# EAGLE design wemos_ora (EAGLE 7.4.0)
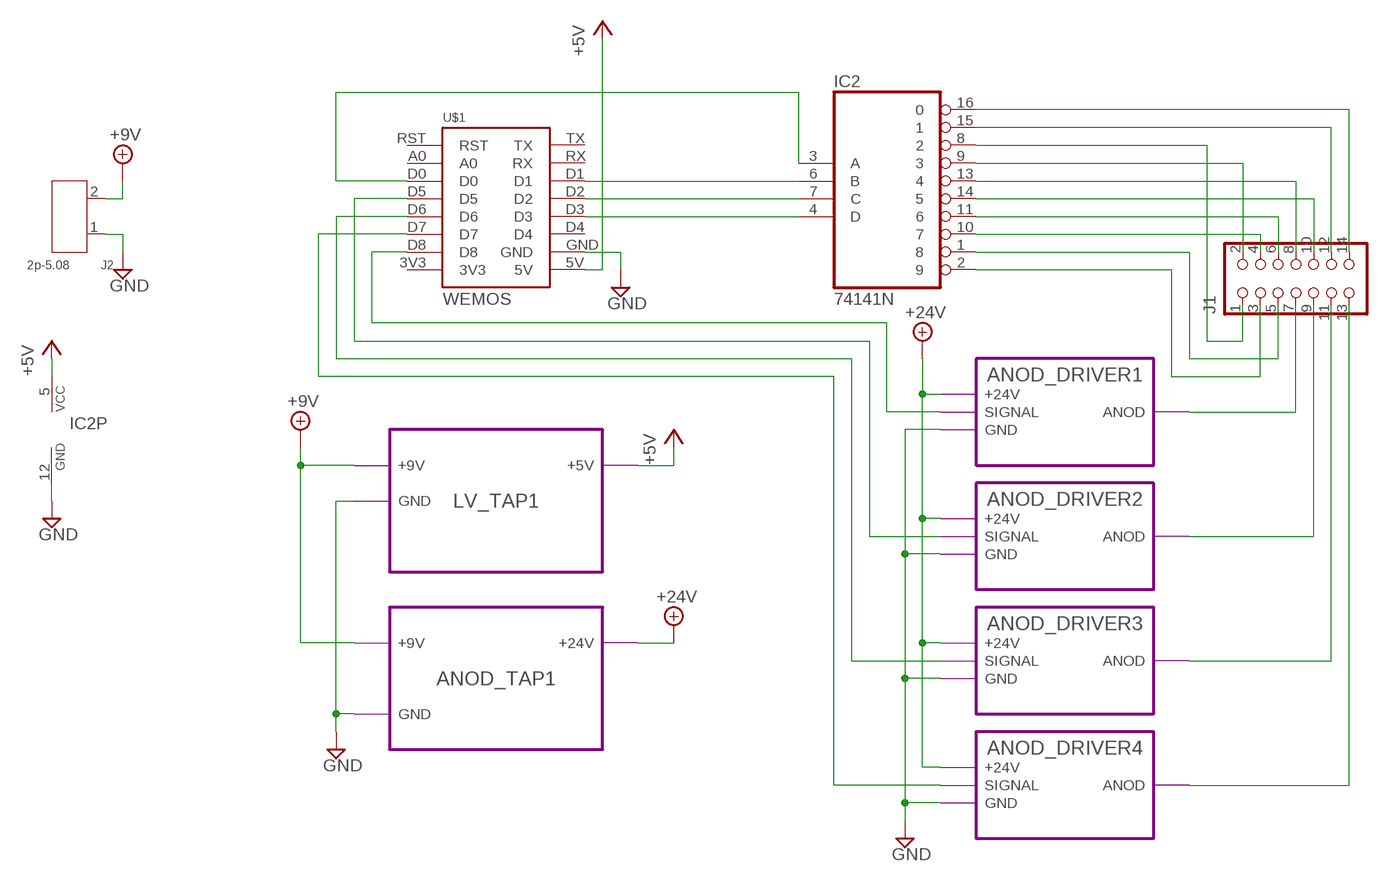
[diagram p0: schematic, sheet 1]

## Parts
IC2  74141N  [DIL16]
J1  CON_HEADER_2X07-PTH  [M2X7]
J2  2p-5.08  DIP-BLUE-SCREW-TERMINAL(2P-5.08)  [H2-5.0-10.5X8.0MM]
U$1  WEMOS  [WEMOS]

## Module instances
ANOD_DRIVER1 = ANOD_DRIVER
ANOD_TAP1 = ANOD_TAP
ANOD_DRIVER2 = ANOD_DRIVER
ANOD_DRIVER3 = ANOD_DRIVER
ANOD_DRIVER4 = ANOD_DRIVER
LV_TAP1 = LV_TAP

## Nets
+5V: IC2.5(VCC) U$1.5V ; port LV_TAP1.+5V
+9V: J2.2 ; port LV_TAP1.+9V ANOD_TAP1.+9V
+24V: port ANOD_TAP1.+24V ANOD_DRIVER1.+24V ANOD_DRIVER2.+24V ANOD_DRIVER3.+24V ANOD_DRIVER4.+24V
GND: IC2.12(GND) J2.1 U$1.GND ; port LV_TAP1.GND ANOD_TAP1.GND ANOD_DRIVER1.GND ANOD_DRIVER2.GND ANOD_DRIVER3.GND ANOD_DRIVER4.GND
N$1: IC2.16 J1.14
N$2: IC2.15 J1.12
N$3: IC2.8 J1.1
N$4: IC2.9 J1.2
N$5: IC2.13 J1.8
N$6: IC2.14 J1.10
N$7: IC2.11 J1.6
N$8: IC2.10 J1.4
N$9: IC2.1 J1.5
N$10: IC2.2 J1.3
N$11: J1.7 ; port ANOD_DRIVER1.ANOD
N$12: J1.9 ; port ANOD_DRIVER2.ANOD
N$13: J1.11 ; port ANOD_DRIVER3.ANOD
N$14: J1.13 ; port ANOD_DRIVER4.ANOD
N$15: IC2.3(A) U$1.D0
N$16: IC2.6(B) U$1.D1
N$17: IC2.7(C) U$1.D2
N$18: IC2.4(D) U$1.D3
N$19: U$1.D8 ; port ANOD_DRIVER1.SIGNAL
N$20: U$1.D5 ; port ANOD_DRIVER2.SIGNAL
N$21: U$1.D6 ; port ANOD_DRIVER3.SIGNAL
N$22: U$1.D7 ; port ANOD_DRIVER4.SIGNAL
Unconnected: U$1.3V3 U$1.A0 U$1.D4 U$1.RST U$1.RX U$1.TX

## Library data of the parts
IC2 = 74xx-eu:74*141: BCD to decimal DECODER/DRIVER
J1 = dp_devices:CON_HEADER_2X07: 2x07 pin header
J2 = Seeed-OPL-Connector:DIP-BLUE-SCREW-TERMINAL(2P-5.08): 320110006; MPN: GS009S-2P-2
U$1 = 1455413453956-wemos:WEMOS

## Module ANOD_DRIVER
Ports: ANOD(in) SIGNAL(in) +24V(pwr) GND(pwr)
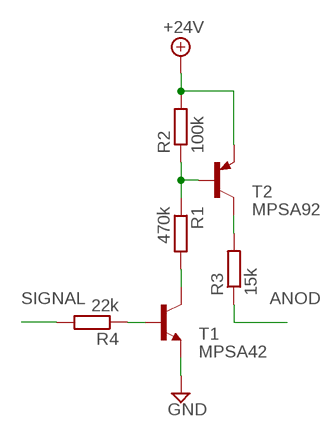
[diagram p1: schematic, module ANOD_DRIVER, sheet 1]

### Parts
R1  470k  R-EU_0204/5  [0204/5]
R2  100k  R-EU_0204/5  [0204/5]
R3  15k  R-EU_0204/5  [0204/5]
R4  22k  R-EU_0204/5  [0204/5]
T1  MPSA42  MPSA42-NPN-TO92-EBC  [TO92-EBC]
T2  MPSA92  MPSA92-PNP-TO92-EBC  [TO92-EBC]

### Nets
+24V: R2.2 T2.E
ANOD: R3.1
GND: T1.E
N$1: R3.2 T2.C
N$2: R1.1 R2.1 T2.B
N$3: R1.2 T1.C
N$4: R4.1 T1.B
SIGNAL: R4.2

### Library data of the parts
R1-R4 = rcl:R-EU_: RESISTOR, European symbol
T1 = transistor:*-NPN-: NPN Transistror BF959 corrected 2008.03.06
T2 = transistor:*-PNP-: PNP Transistror

## Module ANOD_TAP
Ports: +9V(pwr) +24V(pwr) GND(pwr)
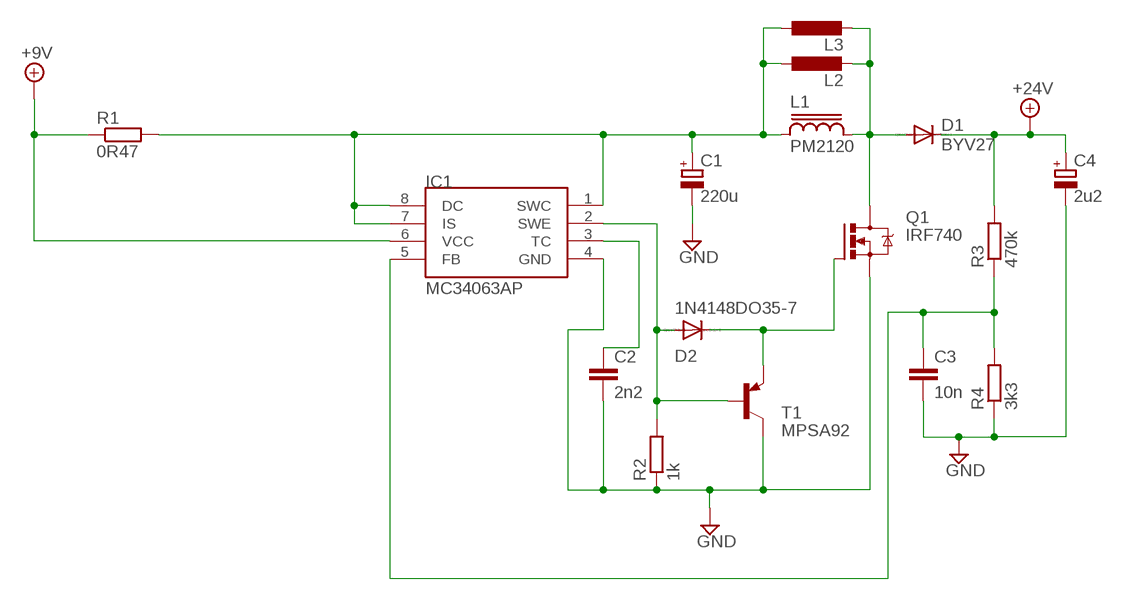
[diagram p2: schematic, module ANOD_TAP, sheet 1]

### Parts
C1  220u  CPOL-EUE3.5-8  [E3,5-8]
C2  2n2  C-EU050-024X044  [C050-024X044]
C3  10n  C-EU050-024X044  [C050-024X044]
C4  2u2  CPOL-EUE3.5-8  [E3,5-8]
D1  BYV27  [SOD57-10]
D2  1N4148DO35-7  [DO35-7]
IC1  MC34063AP  [DIL08]
L1  PM2120  [PM2120]
L2  L-EUTJ3-U1  [TJ3-U1]
L3  L-EUTJ3-U2  [TJ3-U2]
Q1  IRF740  [TO220BV]
R1  0R47  R-EU_0922/22  [0922/22]
R2  1k  R-EU_0204/5  [0204/5]
R3  470k  R-EU_0204/5  [0204/5]
R4  3k3  R-EU_0204/5  [0204/5]
T1  MPSA92  MPSA92-PNP-TO92-EBC  [TO92-EBC]

### Nets
+9V: IC1.6(VCC) R1.1
+24V: C4.+ D1.C R3.2
GND: C1.- C2.2 C3.2 C4.- IC1.4(GND) Q1.S R2.1 R4.1 T1.C
N$1: C1.+ IC1.1(SWC) IC1.7(IS) IC1.8(DC) L1.1 L2.1 L3.1 R1.2
N$3: D1.A L1.2 L2.2 L3.2 Q1.D
N$4: D2.A IC1.2(SWE) R2.2 T1.B
N$5: D2.C Q1.G T1.E
N$8: C2.1 IC1.3(TC)
N$14: C3.1 IC1.5(FB) R3.1 R4.2

### Library data of the parts
C1 C4 = rcl:CPOL-EU: POLARIZED CAPACITOR, European symbol
C2 C3 = rcl:C-EU: CAPACITOR, European symbol
D1 = diode:BYV27: DIODE ultra fast
D2 = diode:1N4148: DIODE high speed (Philips)
IC1 = mc34063:MC34063
L1 = inductor-bourns:PM2120: POWER INDUCTOR
L2 L3 = rcl:L-EU: INDUCTOR, European symbol
Q1 = transistor-power:IRF740: N-CHANNEL MOS FET
R1-R4 = rcl:R-EU_: RESISTOR, European symbol
T1 = transistor:*-PNP-: PNP Transistror

## Module LV_TAP
Ports: +9V(pwr) GND(pwr) +5V(pwr)
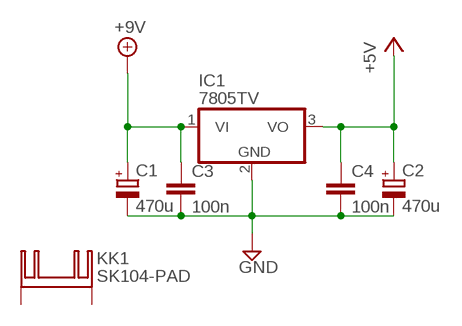
[diagram p3: schematic, module LV_TAP, sheet 1]

### Parts
C1  470u  CPOL-EUE3.5-8  [E3,5-8]
C2  470u  CPOL-EUE3.5-8  [E3,5-8]
C3  100n  C-EU050-030X075  [C050-030X075]
C4  100n  C-EU050-030X075  [C050-030X075]
IC1  7805TV  [TO220V]
KK1  SK104-PAD  [SK104-PAD]

### Nets
+5V: C2.+ C4.1 IC1.3(VO)
+9V: C1.+ C3.1 IC1.1(VI)
GND: C1.- C2.- C3.2 C4.2 IC1.2(GND)
Unconnected: KK1.K1(K) KK1.K2(K)

### Library data of the parts
C1 C2 = rcl:CPOL-EU: POLARIZED CAPACITOR, European symbol
C3 C4 = rcl:C-EU: CAPACITOR, European symbol
IC1 = linear:78*: Positive VOLTAGE REGULATOR Source: http://cache.national.com/ds/LM/LM78L05.pdf http://www.fairchildsemi.com/ds/LM/LM7805.pdf
KK1 = heatsink:SK104-PAD: HEATSINK manufacturer Fischer/distributor Buerklin

## Board
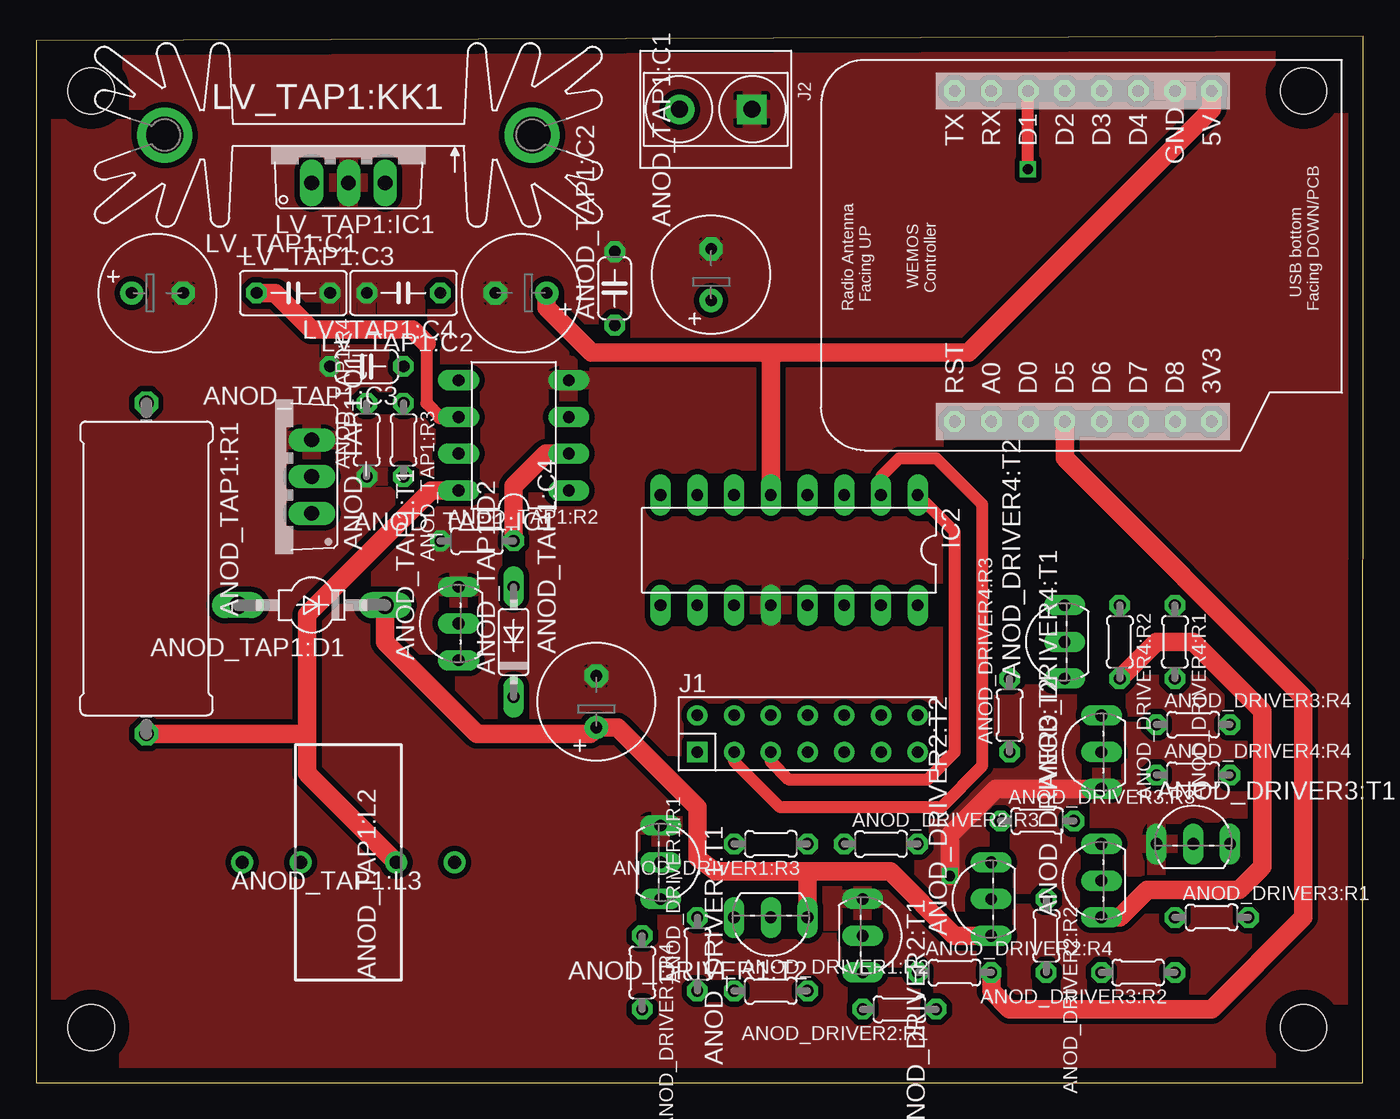
[diagram p4: board, top side]
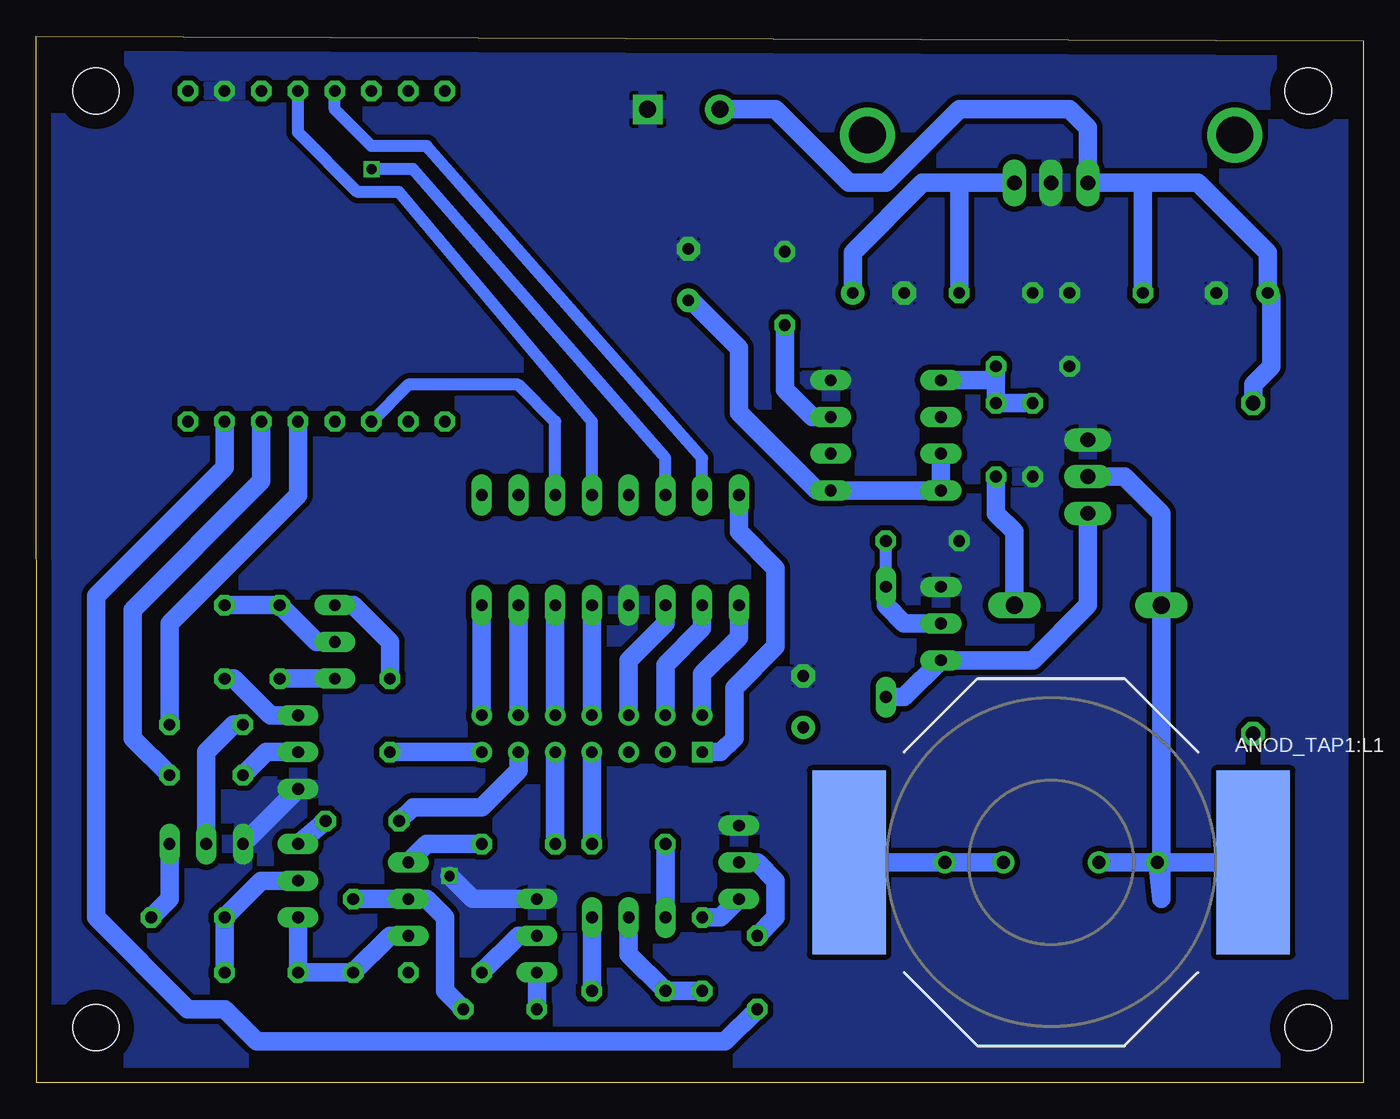
[diagram p5: board, bottom side, seen from below]

Size 91.77 x 72.37 mm. Coordinates in mm from the lower left corner, seen from the top.
Outline: 0,0 91.74,0 91.77,72.37 0,72.06 0,0
Copper layers (1*16): Top 0.035mm / dielectric 1.5mm / Bottom 0.035mm
Design rules "default *": minimum track width 10mil, minimum drill 27mil, track to track 15mil, track to pad 15mil, pad to pad 15mil, via to via 15mil, smd to smd 15mil, copper to edge 40mil, drill to drill 15mil, minimum pad ring 12mil, minimum via ring 8mil, stop-mask expansion 4mil, vias tented up to drill 0mil, thermal gap 10mil
Holes 3.2 mm at 3.81,3.81 87.63,3.81 87.63,68.58 3.81,68.58

### Footprints (pad centres in the part's own frame; a part is rotated, then mirrored left to right if it is on the bottom)
0204/5 = drill 0.813 octagon: 1 -2.54,0; 2 2.54,0
TO92-EBC = drill 0.813 long: B 0,-1.27; C 2.54,-1.27; E -2.54,-1.27
E3,5-8 = drill 0.813 pad 1.6: + -1.778,0 | drill 0.813 pad 1.6 octagon: - 1.778,0
C050-024X044 = drill 0.813 octagon: 1 -2.54,0; 2 2.54,0
SOD57-10 = drill 1.194 long: A 5.08,0; C -5.08,0
DO35-7 = drill 0.813 long: A 3.81,0; C -3.81,0
DIL08 = drill 0.813 long: 1 -3.81,-3.81; 2 -1.27,-3.81; 3 1.27,-3.81; 4 3.81,-3.81; 5 3.81,3.81; 6 1.27,3.81; 7 -1.27,3.81; 8 -3.81,3.81
PM2120 = smd 5.08 x 12.7: 1 -13.97,0; 2 13.97,0
TJ3-U1 = drill 0.9: 1 -3.3,0; 2 3.3,0
TJ3-U2 = drill 0.9: 1 -7.35,0; 2 7.35,0
TO220BV = drill 1.016 long: D 0,-2.54; G -2.54,-2.54; S 2.54,-2.54
0922/22 = drill 1.016 octagon: 1 -11.43,0; 2 11.43,0
DIL16 = drill 0.813 long: 1 -8.89,-3.81; 2 -6.35,-3.81; 3 -3.81,-3.81; 4 -1.27,-3.81; 5 1.27,-3.81; 6 3.81,-3.81; 7 6.35,-3.81; 8 8.89,-3.81; 9 8.89,3.81; 10 6.35,3.81; 11 3.81,3.81; 12 1.27,3.81; 13 -1.27,3.81; 14 -3.81,3.81; 15 -6.35,3.81; 16 -8.89,3.81
M2X7 = drill 0.8 square: 1 -7.62,-1.27 | drill 0.8: 2 -7.62,1.27; 3 -5.08,-1.27; 4 -5.08,1.27; 5 -2.54,-1.27; 6 -2.54,1.27; 7 0,-1.27; 8 0,1.27; 9 2.54,-1.27; 10 2.54,1.27; 11 5.08,-1.27; 12 5.08,1.27; 13 7.62,-1.27; 14 7.62,1.27
H2-5.0-10.5X8.0MM = drill 1.168 pad 2.032 square: 1 0,2.5 | drill 1.168 pad 2.032: 2 0,-2.5
C050-030X075 = drill 0.813 octagon: 1 -2.54,0; 2 2.54,0
TO220V = drill 1.016 long: 1 -2.54,-2.54; 2 0,-2.54; 3 2.54,-2.54
SK104-PAD = drill 2.54 pad 3.81: K1 -12.7,-0.762; K2 12.7,-0.762
WEMOS = drill 0.8 octagon: 3V3 0,0; 5V 22.86,0; A0 0,15.24; D0 0,12.7; D1 22.86,12.7; D2 22.86,10.16; D3 22.86,7.62; D4 22.86,5.08; D5 0,10.16; D6 0,7.62; D7 0,5.08; D8 0,2.54; GND 22.86,2.54; RST 0,17.78; RX 22.86,15.24; TX 22.86,17.78

### Placement (x,y rotation side)
ANOD_DRIVER1:R1  470k  [0204/5]  45.72,8.89 90 top
ANOD_DRIVER1:R2  100k  [0204/5]  50.8,6.35 0 top
ANOD_DRIVER1:R3  15k  [0204/5]  50.8,16.51 180 top
ANOD_DRIVER1:R4  22k  [0204/5]  41.91,7.62 270 top
ANOD_DRIVER1:T1  MPSA42  [TO92-EBC]  44.45,15.24 270 top
ANOD_DRIVER1:T2  MPSA92  [TO92-EBC]  50.8,10.16 180 top
ANOD_DRIVER2:R1  470k  [0204/5]  59.69,5.08 180 top
ANOD_DRIVER2:R2  100k  [0204/5]  69.85,10.16 270 top
ANOD_DRIVER2:R3  15k  [0204/5]  58.42,16.51 0 top
ANOD_DRIVER2:R4  22k  [0204/5]  63.5,7.62 0 top
ANOD_DRIVER2:T1  MPSA42  [TO92-EBC]  58.42,10.16 270 top
ANOD_DRIVER2:T2  MPSA92  [TO92-EBC]  64.77,12.7 90 top
ANOD_DRIVER3:R1  470k  [0204/5]  81.28,11.43 0 top
ANOD_DRIVER3:R2  100k  [0204/5]  76.2,7.62 180 top
ANOD_DRIVER3:R3  15k  [0204/5]  69.22,18.1 0 top
ANOD_DRIVER3:R4  22k  [0204/5]  80.01,24.76 0 top
ANOD_DRIVER3:T1  MPSA42  [TO92-EBC]  80.01,17.78 0 top
ANOD_DRIVER3:T2  MPSA92  [TO92-EBC]  72.39,13.97 90 top
ANOD_DRIVER4:R1  470k  [0204/5]  78.74,30.48 270 top
ANOD_DRIVER4:R2  100k  [0204/5]  74.93,30.48 270 top
ANOD_DRIVER4:R3  15k  [0204/5]  67.31,25.4 90 top
ANOD_DRIVER4:R4  22k  [0204/5]  80.01,21.27 0 top
ANOD_DRIVER4:T1  MPSA42  [TO92-EBC]  72.39,22.86 90 top
ANOD_DRIVER4:T2  MPSA92  [TO92-EBC]  69.85,30.48 90 top
ANOD_TAP1:C1  220u  [E3,5-8]  46.67,55.88 90 top
ANOD_TAP1:C2  2n2  [C050-024X044]  40.01,54.93 90 top
ANOD_TAP1:C3  10n  [C050-024X044]  22.86,49.53 180 top
ANOD_TAP1:C4  2u2  [E3,5-8]  38.73,26.35 90 top
ANOD_TAP1:D1  BYV27  [SOD57-10]  19.05,33.02 180 top
ANOD_TAP1:D2  1N4148DO35-7  [DO35-7]  33.02,30.48 90 top
ANOD_TAP1:IC1  MC34063AP  [DIL08]  33.02,44.77 90 top
ANOD_TAP1:L1  PM2120  [PM2120]  21.59,15.24 0 bottom
ANOD_TAP1:L2  [TJ3-U1]  21.59,15.24 180 top
ANOD_TAP1:L3  [TJ3-U2]  21.59,15.24 180 top
ANOD_TAP1:Q1  IRF740  [TO220BV]  16.51,41.91 90 top
ANOD_TAP1:R1  0R47  [0922/22]  7.62,35.56 270 top
ANOD_TAP1:R2  1k  [0204/5]  30.48,37.47 0 top
ANOD_TAP1:R3  470k  [0204/5]  25.4,44.45 270 top
ANOD_TAP1:R4  3k3  [0204/5]  22.86,44.45 90 top
ANOD_TAP1:T1  MPSA92  [TO92-EBC]  27.94,31.75 90 top
IC2  52.07,36.83 180 top
J1  53.34,24.13 0 top
J2  46.99,67.31 270 top
LV_TAP1:C1  470u  [E3,5-8]  8.38,54.61 0 top
LV_TAP1:C2  470u  [E3,5-8]  33.53,54.61 180 top
LV_TAP1:C3  100n  [C050-030X075]  17.78,54.61 0 top
LV_TAP1:C4  100n  [C050-030X075]  25.4,54.61 180 top
LV_TAP1:IC1  7805TV  [TO220V]  21.59,64.77 0 top
LV_TAP1:KK1  SK104-PAD  [SK104-PAD]  21.59,64.77 180 top
U$1  81.28,45.72 90 top

### Tracks (layer width: path | path; a pad name or v marks a point on that pad's centre or on a via)
+5V
  Top 1.27: LV_TAP1:C2.+ 35.31,53.59 38.42,50.48 50.8,50.48 | U$1.5V 81.28,67.31 64.45,50.48 50.8,50.48 | IC2.5 50.8,50.48
  Bottom 1.27: LV_TAP1:C2.+ 35.31,57.4 30.48,62.23 27.94,62.23 | 27.94,62.23 LV_TAP1:IC1.3 | LV_TAP1:C4.1 27.94,62.23
+9V
  Top 0.813: 26.99,51.12 26.99,46.99 27.94,46.04
  Top 1.016: 27.94,46.04 ANOD_TAP1:IC1.6
  Top 1.27: LV_TAP1:C3.1 16.51,54.61 19.05,52.07 26.04,52.07 26.99,51.12
  Bottom 1.27: ANOD_TAP1:R1.1 7.62,48.26 6.35,49.53 6.35,54.36 LV_TAP1:C1.+ 6.6,57.4 11.43,62.23 15.24,62.23 | 15.24,62.23 LV_TAP1:IC1.1 19.05,66.04 20.32,67.31 27.94,67.31 33.02,62.23 35.56,62.23 40.64,67.31 J2.2 | LV_TAP1:C3.1 15.24,62.23
+24V
  Top 1.27: ANOD_TAP1:D1.C 24.13,30.48 30.48,24.13 38.29,24.13 ANOD_TAP1:C4.+ 40.2,24.57 45.72,19.05 45.72,15.56 46.99,14.61 53.34,14.61 | 53.34,14.61 59.05,14.61 63.5,10.16 ANOD_DRIVER2:T2.E | ANOD_DRIVER1:T2.E 53.34,14.61 | ANOD_DRIVER3:T2.E 74.93,11.43 76.83,13.33 83.19,13.33 84.77,14.92 84.77,25.72 80.01,30.48 77.47,30.48 ANOD_DRIVER4:R2.2
  Bottom 1.27: ANOD_TAP1:D1.C 24.13,38.1 25.4,39.37 ANOD_TAP1:R3.2 | ANOD_DRIVER1:R2.2 ANOD_DRIVER1:T2.E | ANOD_DRIVER3:T2.E ANOD_DRIVER3:R2.2 ANOD_DRIVER2:R2.2 67.31,10.16 ANOD_DRIVER2:T2.E | ANOD_DRIVER4:T2.E ANOD_DRIVER4:R2.2
ANOD_DRIVER1:N$1
  Bottom 1.27: ANOD_DRIVER1:T2.C ANOD_DRIVER1:R3.2
ANOD_DRIVER1:N$2
  Bottom 1.27: ANOD_DRIVER1:R1.1 ANOD_DRIVER1:R2.1 50.8,8.89 ANOD_DRIVER1:T2.B
ANOD_DRIVER1:N$3
  Bottom 1.27: ANOD_DRIVER1:R1.2 44.45,11.43 ANOD_DRIVER1:T1.C
ANOD_DRIVER1:N$4
  Bottom 1.27: ANOD_DRIVER1:T1.B 41.91,15.24 40.64,13.97 40.64,11.43 ANOD_DRIVER1:R4.1
ANOD_DRIVER2:N$1
  Bottom 1.27: ANOD_DRIVER2:R3.2 64.77,16.51 ANOD_DRIVER2:T2.C
ANOD_DRIVER2:N$2
  Bottom 1.27: ANOD_DRIVER2:R1.1 63.5,6.35 63.5,11.43 64.77,12.7 ANOD_DRIVER2:T2.B ANOD_DRIVER2:R2.1
ANOD_DRIVER2:N$3
  Bottom 1.27: ANOD_DRIVER2:R1.2 ANOD_DRIVER2:T1.C
ANOD_DRIVER2:N$4
  Bottom 1.27: ANOD_DRIVER2:T1.B 58.42,10.16 ANOD_DRIVER2:R4.1
ANOD_DRIVER3:N$1
  Bottom 1.27: ANOD_DRIVER3:R3.2 ANOD_DRIVER3:T2.C
ANOD_DRIVER3:N$2
  Bottom 1.27: ANOD_DRIVER3:T2.B 76.2,13.97 ANOD_DRIVER3:R1.1 ANOD_DRIVER3:R2.1
ANOD_DRIVER3:N$3
  Bottom 1.27: ANOD_DRIVER3:T1.C 82.55,12.7 ANOD_DRIVER3:R1.2
ANOD_DRIVER3:N$4
  Bottom 1.27: ANOD_DRIVER3:R4.1 78.11,24.76 80.01,22.86 ANOD_DRIVER3:T1.B
ANOD_DRIVER4:N$1
  Bottom 1.27: ANOD_DRIVER4:R3.2 67.31,30.48 69.85,33.02 ANOD_DRIVER4:T2.C
ANOD_DRIVER4:N$2
  Bottom 1.27: ANOD_DRIVER4:T2.B 72.39,30.48 ANOD_DRIVER4:R2.1 ANOD_DRIVER4:R1.1
ANOD_DRIVER4:N$3
  Bottom 1.27: ANOD_DRIVER4:T1.C 75.56,25.4 78.11,27.94 ANOD_DRIVER4:R1.2
ANOD_DRIVER4:N$4
  Bottom 1.27: ANOD_DRIVER4:T1.B 75.88,22.86 ANOD_DRIVER4:R4.1
ANOD_TAP1:N$1
  Top 1.27: ANOD_TAP1:IC1.8 27.3,40.96 18.73,32.39 18.73,24.13 | ANOD_TAP1:R1.2 18.73,24.13 | 18.73,24.13 18.73,21.4 ANOD_TAP1:L2.1
  Bottom 1.27: ANOD_TAP1:IC1.7 ANOD_TAP1:IC1.8 ANOD_TAP1:IC1.1 37.78,40.96 43.18,46.35 43.18,50.8 46.48,54.1 ANOD_TAP1:C1.+ | ANOD_TAP1:L1.1 ANOD_TAP1:L3.1 ANOD_TAP1:L2.1
ANOD_TAP1:N$3
  Bottom 1.27: ANOD_TAP1:Q1.D 16.51,41.91 13.97,39.37 ANOD_TAP1:D1.A 13.97,12.7 ANOD_TAP1:L3.2 | ANOD_TAP1:L3.2 ANOD_TAP1:L1.2 | ANOD_TAP1:L3.2 ANOD_TAP1:L2.2
ANOD_TAP1:N$4
  Top 1.27: ANOD_TAP1:R2.2 33.02,41.28 35.24,43.5 ANOD_TAP1:IC1.2
  Bottom 0.813: ANOD_TAP1:D2.A ANOD_TAP1:R2.2
  Bottom 1.27: ANOD_TAP1:D2.A 33.02,33.02 31.75,31.75 ANOD_TAP1:T1.B
ANOD_TAP1:N$5
  Bottom 1.27: ANOD_TAP1:Q1.G 19.05,33.02 22.86,29.21 ANOD_TAP1:T1.E 31.75,26.67 ANOD_TAP1:D2.C
ANOD_TAP1:N$8
  Bottom 1.27: ANOD_TAP1:C2.1 40.01,47.94 38.1,46.04 ANOD_TAP1:IC1.3
ANOD_TAP1:N$14
  Bottom 1.27: ANOD_TAP1:R4.2 ANOD_TAP1:R3.1 ANOD_TAP1:C3.1 25.4,48.58 ANOD_TAP1:IC1.5
GND  (via drill 0.7)
  Top 1.27: v63.18,14.29 63.18,17.14 66.36,20.32 ANOD_DRIVER4:T1.E 72.39,20.32
  Bottom 1.27: ANOD_DRIVER4:T1.E ANOD_DRIVER3:T1.E | ANOD_DRIVER2:T1.E 61.59,12.7 v63.18,14.29
  pour Top: 0,72.39 91.44,72.39 91.44,0 0,0
  pour Bottom: 0,72.39 91.44,72.39 91.44,0 0,0
N$1
  Bottom 1.27: IC2.16 J1.14
N$2
  Bottom 1.27: IC2.15 J1.12
N$3
  Bottom 1.27: IC2.8 43.18,38.1 40.64,35.56 40.64,30.16 43.5,27.31 43.5,23.81 44.45,22.86 J1.1
N$4
  Bottom 1.27: IC2.9 43.18,30.8 45.72,28.26 J1.2
N$5
  Bottom 1.27: IC2.13 J1.8
N$6
  Bottom 1.27: IC2.14 J1.10
N$7
  Bottom 1.27: IC2.11 48.26,31.75 50.8,29.21 J1.6
N$8
  Bottom 1.27: IC2.10 45.72,31.43 48.26,28.89 J1.4
N$9
  Top 0.813: IC2.1 63.5,38.1 63.5,22.86 61.59,20.96 52.07,20.96 50.8,22.22 J1.5
N$10
  Top 0.813: IC2.2 58.42,41.91 59.69,43.18 62.23,43.18 65.41,40 65.41,21.91 62.55,19.05 51.44,19.05 48.26,22.22 J1.3
N$11
  Bottom 1.27: J1.7 ANOD_DRIVER1:R3.1
N$12
  Bottom 1.27: J1.9 ANOD_DRIVER2:R3.1
N$13
  Bottom 1.27: J1.11 58.42,21.59 60.96,19.05 65.72,19.05 ANOD_DRIVER3:R3.1
N$14
  Bottom 1.27: ANOD_DRIVER4:R3.1 J1.13
N$15
  Bottom 0.813: IC2.3 55.88,45.72 58.42,48.26 66.04,48.26 U$1.D0
N$16  (via drill 0.7)
  Top 0.813: v68.58,63.18 U$1.D1
  Bottom 0.813: IC2.6 48.26,43.18 65.72,63.18 v68.58,63.18
N$17
  Bottom 0.813: IC2.7 45.72,43.18 64.77,64.77 68.58,64.77 71.12,67.31 U$1.D2
N$18
  Bottom 0.813: IC2.4 53.34,45.72 66.67,61.59 69.53,61.59 73.66,65.72 U$1.D3
N$19
  Bottom 1.27: ANOD_DRIVER1:R4.2 44.13,2.86 76.52,2.86 78.74,5.08 81.28,5.08 87.63,11.43 87.63,33.66 78.74,42.55 U$1.D8
N$20
  Top 1.27: ANOD_DRIVER2:R4.2 66.04,6.35 67.31,5.08 81.28,5.08 87.63,11.43 87.63,26.67 71.12,43.18 U$1.D5
N$21
  Bottom 1.27: ANOD_DRIVER3:R4.2 82.55,31.75 73.66,40.64 U$1.D6
N$22
  Bottom 1.27: ANOD_DRIVER4:R4.2 85.09,23.81 85.09,32.7 76.2,41.59 U$1.D7